# EAGLE design main_board (EAGLE 9.6.2)

## Sheet 1 of 2
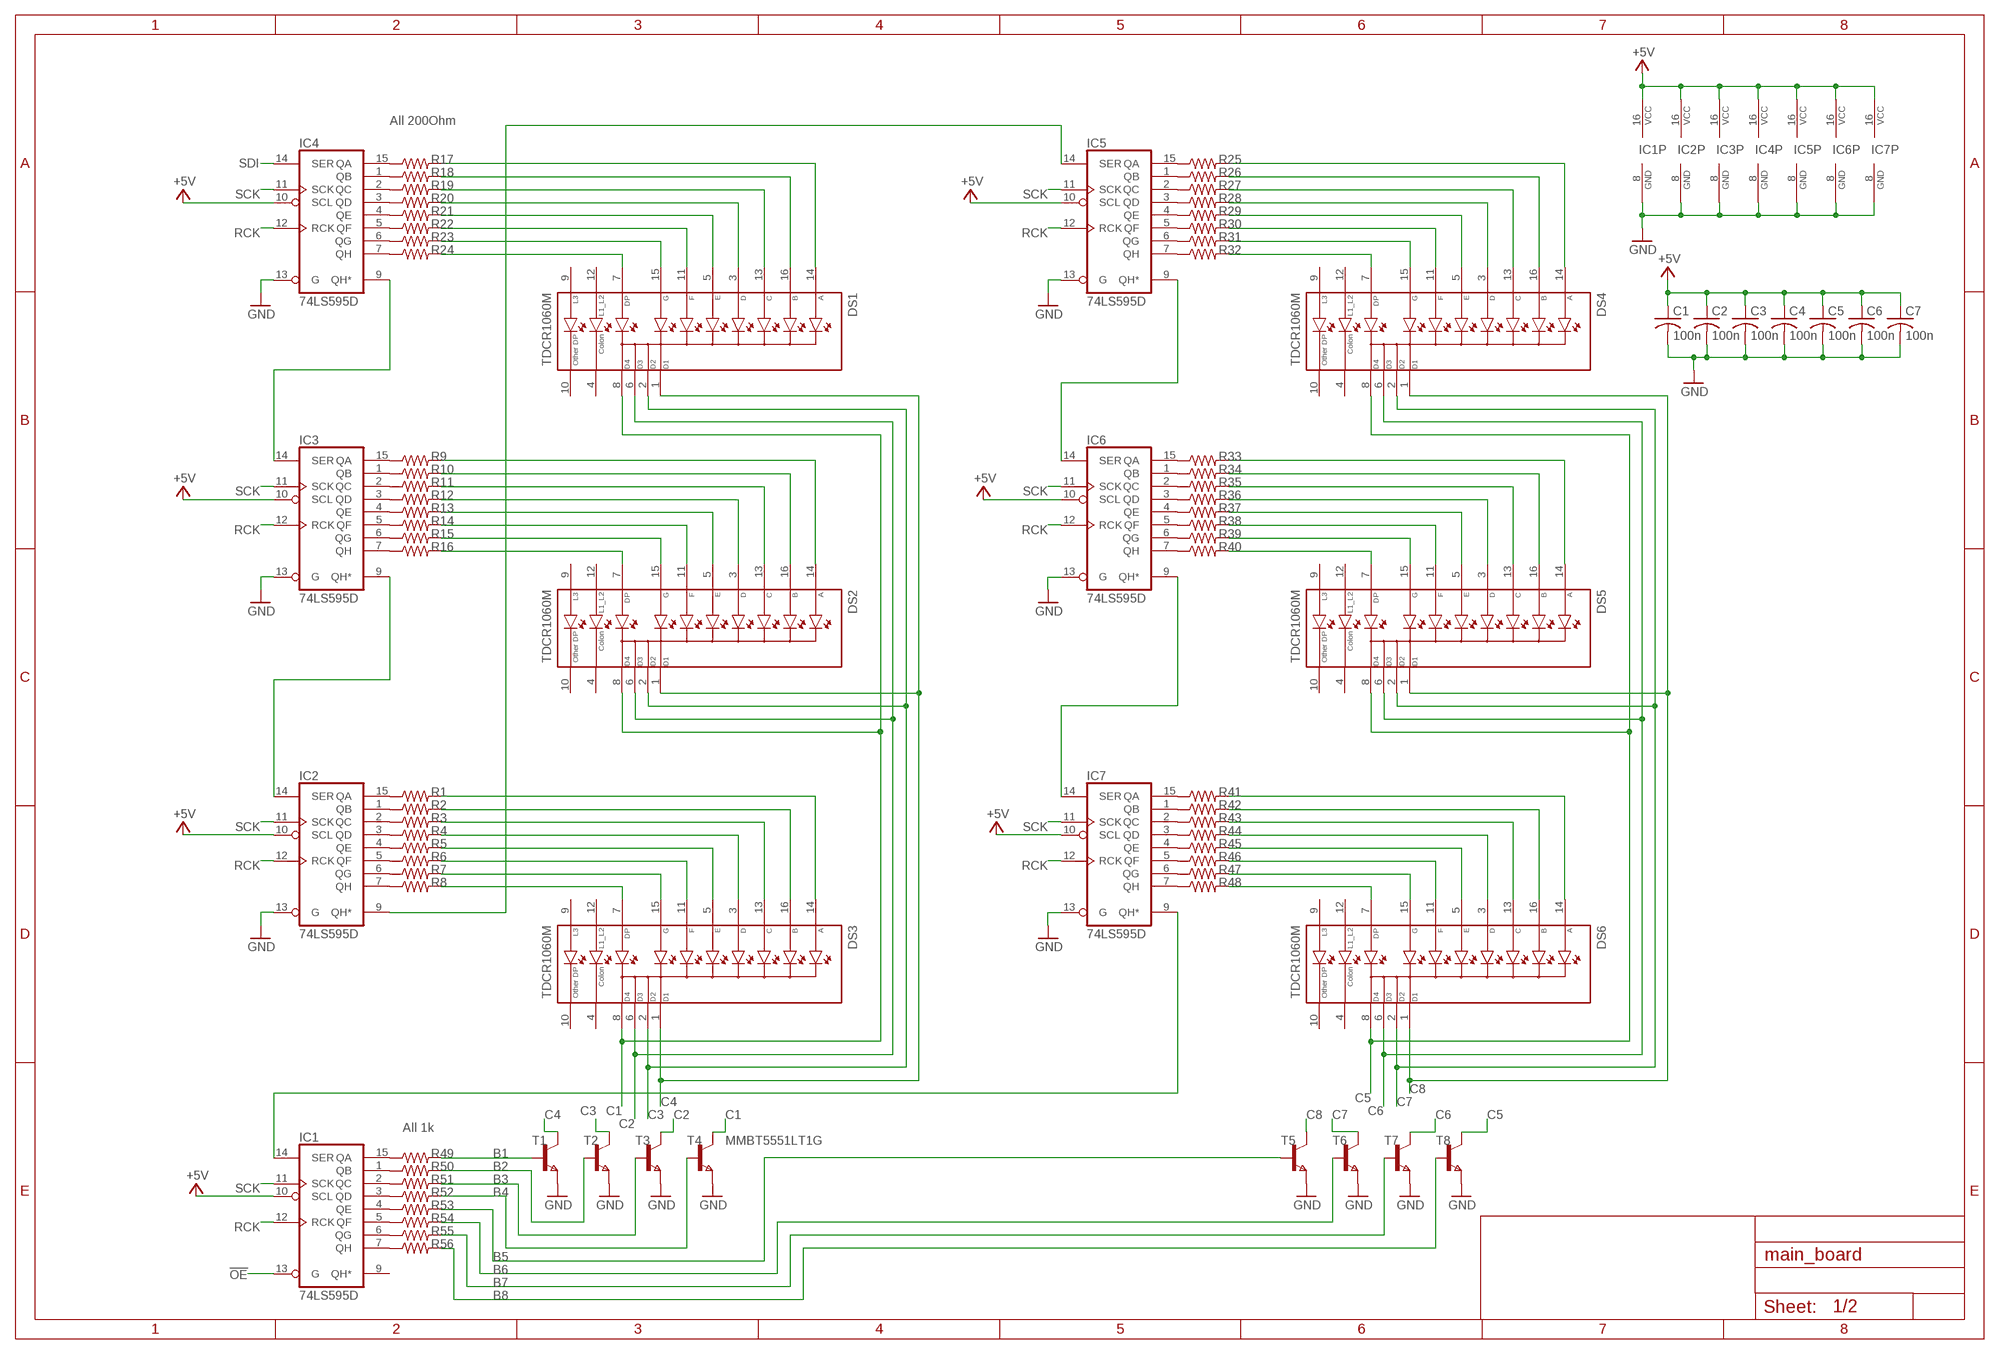
[diagram p0: schematic, sheet 1]

### Parts
C1  100n  C-USC0603  [C0603]
C2  100n  C-USC0603  [C0603]
C3  100n  C-USC0603  [C0603]
C4  100n  C-USC0603  [C0603]
C5  100n  C-USC0603  [C0603]
C6  100n  C-USC0603  [C0603]
C7  100n  C-USC0603  [C0603]
DS1  TDCR1060M  [DISPLAY_TDCR1060M]
DS2  TDCR1060M  [DISPLAY_TDCR1060M]
DS3  TDCR1060M  [DISPLAY_TDCR1060M]
DS4  TDCR1060M  [DISPLAY_TDCR1060M]
DS5  TDCR1060M  [DISPLAY_TDCR1060M]
DS6  TDCR1060M  [DISPLAY_TDCR1060M]
IC1  74LS595D  [SO16]
IC2  74LS595D  [SO16]
IC3  74LS595D  [SO16]
IC4  74LS595D  [SO16]
IC5  74LS595D  [SO16]
IC6  74LS595D  [SO16]
IC7  74LS595D  [SO16]
R1  R-US_R0603  [R0603]
R2  R-US_R0603  [R0603]
R3  R-US_R0603  [R0603]
R4  R-US_R0603  [R0603]
R5  R-US_R0603  [R0603]
R6  R-US_R0603  [R0603]
R7  R-US_R0603  [R0603]
R8  R-US_R0603  [R0603]
R9  R-US_R0603  [R0603]
R10  R-US_R0603  [R0603]
R11  R-US_R0603  [R0603]
R12  R-US_R0603  [R0603]
R13  R-US_R0603  [R0603]
R14  R-US_R0603  [R0603]
R15  R-US_R0603  [R0603]
R16  R-US_R0603  [R0603]
R17  R-US_R0603  [R0603]
R18  R-US_R0603  [R0603]
R19  R-US_R0603  [R0603]
R20  R-US_R0603  [R0603]
R21  R-US_R0603  [R0603]
R22  R-US_R0603  [R0603]
R23  R-US_R0603  [R0603]
R24  R-US_R0603  [R0603]
R25  R-US_R0603  [R0603]
R26  R-US_R0603  [R0603]
R27  R-US_R0603  [R0603]
R28  R-US_R0603  [R0603]
R29  R-US_R0603  [R0603]
R30  R-US_R0603  [R0603]
R31  R-US_R0603  [R0603]
R32  R-US_R0603  [R0603]
R33  R-US_R0603  [R0603]
R34  R-US_R0603  [R0603]
R35  R-US_R0603  [R0603]
R36  R-US_R0603  [R0603]
R37  R-US_R0603  [R0603]
R38  R-US_R0603  [R0603]
R39  R-US_R0603  [R0603]
R40  R-US_R0603  [R0603]
R41  R-US_R0603  [R0603]
R42  R-US_R0603  [R0603]
R43  R-US_R0603  [R0603]
R44  R-US_R0603  [R0603]
R45  R-US_R0603  [R0603]
R46  R-US_R0603  [R0603]
R47  R-US_R0603  [R0603]
R48  R-US_R0603  [R0603]
R49  R-US_R0603  [R0603]
R50  R-US_R0603  [R0603]
R51  R-US_R0603  [R0603]
R52  R-US_R0603  [R0603]
R53  R-US_R0603  [R0603]
R54  R-US_R0603  [R0603]
R55  R-US_R0603  [R0603]
R56  R-US_R0603  [R0603]
T1  NPNSOT23  [SOT-23]
T2  NPNSOT23  [SOT-23]
T3  NPNSOT23  [SOT-23]
T4  NPNSOT23  [SOT-23]
T5  NPNSOT23  [SOT-23]
T6  NPNSOT23  [SOT-23]
T7  NPNSOT23  [SOT-23]
T8  NPNSOT23  [SOT-23]

### Nets
!OE: IC1.13(G) ; also sheet 2
+5V: C1.1 C2.1 C3.1 C4.1 C5.1 C6.1 C7.1 IC1.10(SCL) IC1.16(VCC) IC2.10(SCL) IC2.16(VCC) IC3.10(SCL) IC3.16(VCC) IC4.10(SCL) IC4.16(VCC) IC5.10(SCL) IC5.16(VCC) IC6.10(SCL) IC6.16(VCC) IC7.10(SCL) IC7.16(VCC) ; also sheet 2
B1: R49.2 T1.3(B)
B2: R50.2 T2.3(B)
B3: R51.2 T3.3(B)
B4: R52.2 T4.3(B)
B5: R53.2 T5.3(B)
B6: R54.2 T6.3(B)
B7: R55.2 T7.3(B)
B8: R56.2 T8.3(B)
C1: DS1.8(D4) DS2.8(D4) DS3.8(D4) T4.1(C)
C2: DS1.6(D3) DS2.6(D3) DS3.6(D3) T3.1(C)
C3: DS1.2(D2) DS2.2(D2) DS3.2(D2) T2.1(C)
C4: DS1.1(D1) DS2.1(D1) DS3.1(D1) T1.1(C)
C5: DS4.8(D4) DS5.8(D4) DS6.8(D4) T8.1(C)
C6: DS4.6(D3) DS5.6(D3) DS6.6(D3) T7.1(C)
C7: DS4.2(D2) DS5.2(D2) DS6.2(D2) T6.1(C)
C8: DS4.1(D1) DS5.1(D1) DS6.1(D1) T5.1(C)
GND: C1.2 C2.2 C3.2 C4.2 C5.2 C6.2 C7.2 IC1.8(GND) IC2.8(GND) IC2.13(G) IC3.8(GND) IC3.13(G) IC4.8(GND) IC4.13(G) IC5.8(GND) IC5.13(G) IC6.8(GND) IC6.13(G) IC7.8(GND) IC7.13(G) T1.2(E) T2.2(E) T3.2(E) T4.2(E) T5.2(E) T6.2(E) T7.2(E) T8.2(E) ; also sheet 2
N$1: IC2.15(QA) R1.1
N$2: IC2.1(QB) R2.1
N$3: IC2.2(QC) R3.1
N$4: IC2.3(QD) R4.1
N$5: IC2.4(QE) R5.1
N$6: IC2.5(QF) R6.1
N$7: IC2.6(QG) R7.1
N$8: IC2.7(QH) R8.1
N$9: IC3.15(QA) R9.1
N$10: IC3.1(QB) R10.1
N$11: IC3.2(QC) R11.1
N$12: IC3.3(QD) R12.1
N$13: IC3.4(QE) R13.1
N$14: IC3.5(QF) R14.1
N$15: IC3.6(QG) R15.1
N$16: IC3.7(QH) R16.1
N$17: DS2.7(DP) R16.2
N$18: DS2.15(G) R15.2
N$19: DS2.11(F) R14.2
N$20: DS2.5(E) R13.2
N$21: DS2.3(D) R12.2
N$22: DS2.13(C) R11.2
N$23: DS2.16(B) R10.2
N$24: DS2.14(A) R9.2
N$25: DS3.7(DP) R8.2
N$26: DS3.15(G) R7.2
N$27: DS3.11(F) R6.2
N$28: DS3.5(E) R5.2
N$29: DS3.3(D) R4.2
N$30: DS3.13(C) R3.2
N$31: DS3.16(B) R2.2
N$32: DS3.14(A) R1.2
N$33: IC4.15(QA) R17.1
N$34: IC4.1(QB) R18.1
N$35: IC4.2(QC) R19.1
N$36: IC4.3(QD) R20.1
N$37: IC4.4(QE) R21.1
N$38: IC4.5(QF) R22.1
N$39: IC4.6(QG) R23.1
N$40: IC4.7(QH) R24.1
N$41: DS1.7(DP) R24.2
N$42: DS1.15(G) R23.2
N$43: DS1.11(F) R22.2
N$44: DS1.5(E) R21.2
N$45: DS1.3(D) R20.2
N$46: DS1.13(C) R19.2
N$47: DS1.16(B) R18.2
N$48: DS1.14(A) R17.2
N$49: IC5.15(QA) R25.1
N$50: IC5.1(QB) R26.1
N$51: IC5.2(QC) R27.1
N$52: IC5.3(QD) R28.1
N$53: IC5.4(QE) R29.1
N$54: IC5.5(QF) R30.1
N$55: IC5.6(QG) R31.1
N$56: IC5.7(QH) R32.1
N$57: DS4.7(DP) R32.2
N$58: DS4.15(G) R31.2
N$59: DS4.11(F) R30.2
N$60: DS4.5(E) R29.2
N$61: DS4.3(D) R28.2
N$62: DS4.13(C) R27.2
N$63: DS4.16(B) R26.2
N$64: DS4.14(A) R25.2
N$65: IC6.15(QA) R33.1
N$66: IC6.1(QB) R34.1
N$67: IC6.2(QC) R35.1
N$68: IC6.3(QD) R36.1
N$69: IC6.4(QE) R37.1
N$70: IC6.5(QF) R38.1
N$71: IC6.6(QG) R39.1
N$72: IC6.7(QH) R40.1
N$73: DS5.7(DP) R40.2
N$74: DS5.15(G) R39.2
N$75: DS5.11(F) R38.2
N$76: DS5.5(E) R37.2
N$77: DS5.3(D) R36.2
N$78: DS5.13(C) R35.2
N$79: DS5.16(B) R34.2
N$80: DS5.14(A) R33.2
N$81: IC7.15(QA) R41.1
N$82: IC7.1(QB) R42.1
N$83: IC7.2(QC) R43.1
N$84: IC7.3(QD) R44.1
N$85: IC7.4(QE) R45.1
N$86: IC7.5(QF) R46.1
N$87: IC7.6(QG) R47.1
N$88: IC7.7(QH) R48.1
N$89: DS6.7(DP) R48.2
N$90: DS6.15(G) R47.2
N$91: DS6.11(F) R46.2
N$92: DS6.5(E) R45.2
N$93: DS6.3(D) R44.2
N$94: DS6.13(C) R43.2
N$95: DS6.16(B) R42.2
N$96: DS6.14(A) R41.2
N$97: IC2.9(QH*) IC5.14(SER)
N$98: IC5.9(QH*) IC6.14(SER)
N$99: IC6.9(QH*) IC7.14(SER)
N$100: IC3.14(SER) IC4.9(QH*)
N$101: IC2.14(SER) IC3.9(QH*)
N$102: IC1.14(SER) IC7.9(QH*)
N$113: IC1.15(QA) R49.1
N$114: IC1.1(QB) R50.1
N$115: IC1.2(QC) R51.1
N$116: IC1.3(QD) R52.1
N$117: IC1.4(QE) R53.1
N$118: IC1.5(QF) R54.1
N$119: IC1.6(QG) R55.1
N$120: IC1.7(QH) R56.1
RCK: IC1.12(RCK) IC2.12(RCK) IC3.12(RCK) IC4.12(RCK) IC5.12(RCK) IC6.12(RCK) IC7.12(RCK) ; also sheet 2
SCK: IC1.11(SCK) IC2.11(SCK) IC3.11(SCK) IC4.11(SCK) IC5.11(SCK) IC6.11(SCK) IC7.11(SCK) ; also sheet 2
SDI: IC4.14(SER) ; also sheet 2
Unconnected: DS1.4 DS1.9(L3) DS1.10 DS1.12(L1_L2) DS2.4 DS2.9(L3) DS2.10 DS2.12(L1_L2) DS3.4 DS3.9(L3) DS3.10 DS3.12(L1_L2) DS4.4 DS4.9(L3) DS4.10 DS4.12(L1_L2) DS5.4 DS5.9(L3) DS5.10 DS5.12(L1_L2) DS6.4 DS6.9(L3) DS6.10 DS6.12(L1_L2) IC1.9(QH*)

### Notes on the sheet
- All 200Ohm
- All 1k
- MMBT5551LT1G

## Sheet 2 of 2
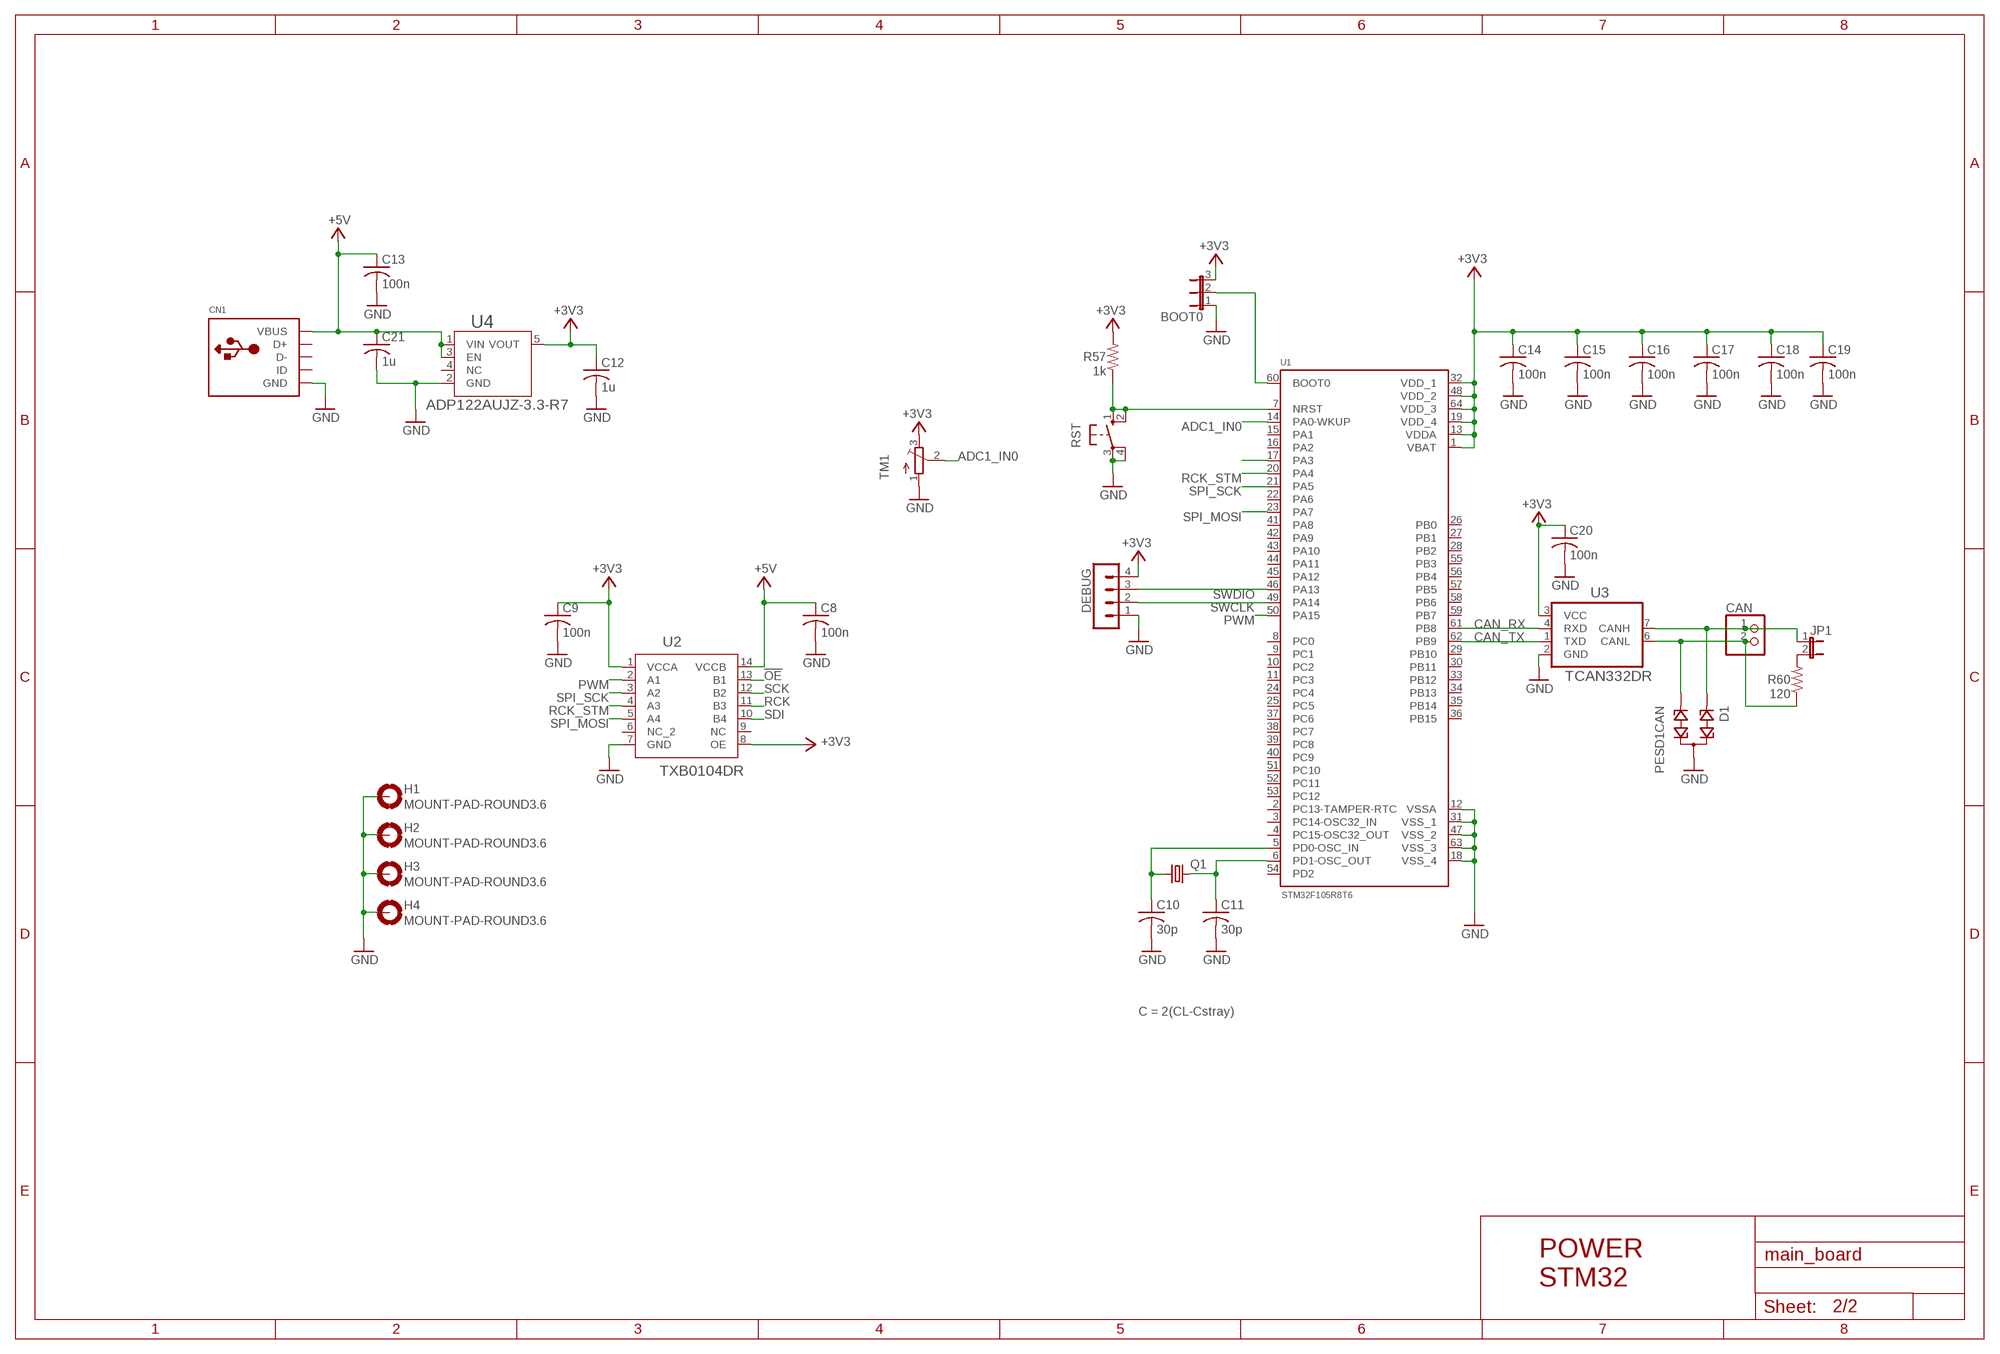
[diagram p1: schematic, sheet 2]

### Parts
BOOT0  JP2E  [JP2]
C8  100n  C-USC0603  [C0603]
C9  100n  C-USC0603  [C0603]
C10  30p  C-USC0603  [C0603]
C11  30p  C-USC0603  [C0603]
C12  1u  C-USC0603  [C0603]
C13  100n  C-USC0603  [C0603]
C14  100n  C-USC0603  [C0603]
C15  100n  C-USC0603  [C0603]
C16  100n  C-USC0603  [C0603]
C17  100n  C-USC0603  [C0603]
C18  100n  C-USC0603  [C0603]
C19  100n  C-USC0603  [C0603]
C20  100n  C-USC0603  [C0603]
C21  1u  C-USC0603  [C0603]
CAN  PINHD-1X2  [1X02]
CN1  USBMINIB  [USB-MINIB]
D1  PESD1CAN  [SOT23]
DEBUG  MA04-1  [MA04-1]
H1  MOUNT-PAD-ROUND3.6  [3,6-PAD]
H2  MOUNT-PAD-ROUND3.6  [3,6-PAD]
H3  MOUNT-PAD-ROUND3.6  [3,6-PAD]
H4  MOUNT-PAD-ROUND3.6  [3,6-PAD]
JP1  JP1E  [JP1]
Q1  CRYSTALHC49S  [HC49/S]
R57  1k  R-US_R0805  [R0805]
R60  120  R-US_R0805  [R0805]
RST  10-XX  [B3F-10XX]
TM1  TRIMPOT3386  [TRIM-3386]
U1  STM32F105R8T6  [QFP50P1200X1200X160-64N]
U2  TXB0104DR  [D14]
U3  TCAN332DR  [SOIC127P599X175-8N]
U4  ADP122AUJZ-3.3-R7  [SOT95P280X100-5N]

### Nets
!OE: U2.13(B1) ; also sheet 1
+3V3: BOOT0.3 C9.1 C12.1 C14.1 C15.1 C16.1 C17.1 C18.1 C19.1 C20.1 DEBUG.4 R57.2 TM1.3(E) U1.1(VBAT) U1.13(VDDA) U1.19(VDD_4) U1.32(VDD_1) U1.48(VDD_2) U1.64(VDD_3) U2.1(VCCA) U2.8(OE) U3.3(VCC) U4.5(VOUT)
+5V: C8.1 C13.1 C21.1 CN1.VBUS U2.14(VCCB) U4.1(VIN) U4.3(EN) ; also sheet 1
ADC1_IN0: TM1.2(S) U1.14(PA0-WKUP)
CAN_RX: U1.61(PB8) U3.4(RXD)
CAN_TX: U1.62(PB9) U3.1(TXD)
GND: BOOT0.1 C8.2 C9.2 C10.2 C11.2 C12.2 C13.2 C14.2 C15.2 C16.2 C17.2 C18.2 C19.2 C20.2 C21.2 CN1.GND D1.3 DEBUG.1 H1.B3,6(MOUNT) H2.B3,6(MOUNT) H3.B3,6(MOUNT) H4.B3,6(MOUNT) RST.3(P) RST.4(P1) TM1.1(A) U1.12(VSSA) U1.18(VSS_4) U1.31(VSS_1) U1.47(VSS_2) U1.63(VSS_3) U2.7(GND) U3.2(GND) U4.2(GND) ; also sheet 1
N$103: CAN.1 D1.1 JP1.1 U3.7(CANH)
N$104: CAN.2 D1.2 R60.1 U3.6(CANL)
N$105: JP1.2 R60.2
N$107: R57.1 RST.1(S) RST.2(S1) U1.7(NRST)
N$108: C10.1 Q1.1 U1.5(PD0-OSC_IN)
N$109: C11.1 Q1.2 U1.6(PD1-OSC_OUT)
N$110: BOOT0.2 U1.60(BOOT0)
N$121: U1.17(PA3)
PWM: U1.50(PA15) U2.2(A1)
RCK: U2.11(B3) ; also sheet 1
RCK_STM: U1.20(PA4) U2.4(A3)
SCK: U2.12(B2) ; also sheet 1
SDI: U2.10(B4) ; also sheet 1
SPI_MOSI: U1.23(PA7) U2.5(A4)
SPI_SCK: U1.21(PA5) U2.3(A2)
SWCLK: DEBUG.2 U1.49(PA14)
SWDIO: DEBUG.3 U1.46(PA13)
Unconnected: CN1.D+ CN1.D- CN1.ID U1.2(PC13-TAMPER-RTC) U1.3(PC14-OSC32_IN) U1.4(PC15-OSC32_OUT) U1.8(PC0) U1.9(PC1) U1.10(PC2) U1.11(PC3) U1.15(PA1) U1.16(PA2) U1.22(PA6) U1.24(PC4) U1.25(PC5) U1.26(PB0) U1.27(PB1) U1.28(PB2) U1.29(PB10) U1.30(PB11) U1.33(PB12) U1.34(PB13) U1.35(PB14) U1.36(PB15) U1.37(PC6) U1.38(PC7) U1.39(PC8) U1.40(PC9) U1.41(PA8) U1.42(PA9) U1.43(PA10) U1.44(PA11) U1.45(PA12) U1.51(PC10) U1.52(PC11) U1.53(PC12) U1.54(PD2) U1.55(PB3) U1.56(PB4) U1.57(PB5) U1.58(PB6) U1.59(PB7) U2.6(NC_2) U2.9(NC) U4.4(NC)

### Notes on the sheet
- C = 2(CL-Cstray)
- POWER
  STM32

## Library data of the parts
BOOT0 = jumper:JP2E: JUMPER
C1-C21 = adafruit:C-US: CAPACITOR, American symbol
CAN = pinhead:PINHD-1X2: PIN HEADER
CN1 = adafruit:USB: USB Connectors USBMINIB - Surface Mount Female Mini-B USB Connector 4UConnector: 06564 By microbuilder.eu Thru-hole RA Female Mini-B USB Connector 4UConnector: 18732 By ladyada.net
D1 = diode:PESD1CAN: CAN bus ESD protection diode Source: http://www.nxp.com/documents/data_sheet/PESD1CAN.pdf
DEBUG = con-lstb:MA04-1: PIN HEADER; OC_FARNELL: unknown; OC_NEWARK: unknown
DS1-DS6 = TDCR1060M:TDCR1060M; CHECK_PRICES: https://www.snapeda.com/parts/TDCR1060M/Vishay+Semiconductor+Opto+Division/view-part/?ref=eda; DESCRIPTION: Display Modules - LED Character and Numeric Red 7-Segment Clock 4 Character Common Cathode 2V 20mA 0.504 H x 1.583 W x 0.276 D (12.80mm x 40.20mm x 7.00mm) 16-DIP (0.400, 10.16mm); DIGIKEY_PART_NUMBER: TDCR1060M-ND; MF: Vishay Semiconductor; MP: TDCR1060M; PACKAGE: None; PURCHASE-URL: https://www.snapeda.com/api/url_track_click_mouser/?unipart_id=2873271&manufacturer=Vishay Semiconductor&part_name=TDCR1060M&search_term=None; SNAPEDA_LINK: https://www.snapeda.com/parts/TDCR1060M/Vishay+Semiconductor+Opto+Division/view-part/?ref=snap
H1-H4 = holes:MOUNT-PAD-ROUND: MOUNTING PAD, round
IC1-IC7 = 74xx-us:74*595: 8-bit SHIFT REGISTER, output latch
JP1 = jumper:JP1E: JUMPER
Q1 = adafruit:CRYSTAL: CRYSTAL; OC_FARNELL: 1667008; OC_NEWARK: unknown
R1-R57 R60 = adafruit:R-US_: RESISTOR, American symbol
RST = switch-omron:10-XX: OMRON SWITCH; MPN: B3F-1000; OC_FARNELL: 176432; OC_NEWARK: 36M3542
T1-T8 = zetex:NPNSOT23: NPN TRANSISTOR; MPN: DSS20201L-7; OC_FARNELL: 1710688; OC_NEWARK: 25R4555
TM1 = adafruit:TRIMPOT: SMT trimmer potentiometer part number TC33X http://www.ladyada.net/library/eagle
U1 = STM32F105R8T6:STM32F105R8T6: Mainstream Connectivity line, ARM Cortex-M3 with 64 Kbytes Flash, 72 MHz CPU, CAN, USB 2.0 OTG; CHECK_PRICES: https://www.snapeda.com/parts/STM32F105R8T6/STMicroelectronics/view-part/?ref=eda; DESCRIPTION: ARM® Cortex®-M3 STM32F1 Microcontroller IC 32-Bit 72MHz 64KB (64K x 8) FLASH 64-LQFP (10x10); DIGIKEY_PART_NUMBER: 497-8922-ND; MF: STMicroelectronics; MP: STM32F105R8T6; PACKAGE: LQFP-64 STMicroelectronics; PURCHASE-URL: https://www.snapeda.com/api/url_track_click_mouser/?unipart_id=423032&manufacturer=STMicroelectronics&part_name=STM32F105R8T6&search_term=None; SNAPEDA_LINK: https://www.snapeda.com/parts/STM32F105R8T6/STMicroelectronics/view-part/?ref=snap
U2 = temp_sens_proj:TXB0104DR; COPYRIGHT: Copyright (C) 2023 Ultra Librarian. All rights reserved.; MANUFACTURER_PART_NUMBER: TXB0104DR; MFR_NAME: Texas Instruments
U3 = TCAN332DR:TCAN332DR: Check availability <https://pricing.snapeda.com/parts/TCAN332DR/Texas%20Instruments/view-part?ref=eda>; AVAILABILITY: In Stock; CHECK_PRICES: https://www.snapeda.com/parts/TCAN332DR/Texas+Instruments/view-part/?ref=eda; DESCRIPTION: 3.3-V CAN Transceivers; MF: Texas Instruments; MP: TCAN332DR; PACKAGE: SOIC-8 Texas Instruments; PRICE: None; PURCHASE-URL: https://www.snapeda.com/api/url_track_click_mouser/?unipart_id=381755&manufacturer=Texas Instruments&part_name=TCAN332DR&search_term=can; SNAPEDA_LINK: https://www.snapeda.com/parts/TCAN332DR/Texas+Instruments/view-part/?ref=snap
U4 = Analog Devices_By_element14_Batch_1:ADP122AUJZ-3.3-R7: CMOS Linear Regulators; MPN: ADP122AUJZ-3.3-R7; OC_FARNELL: 1858064; OC_NEWARK: 60R3274; PACKAGE: SOT-23-5; SUPPLIER: ANALOG DEVICES

## Board
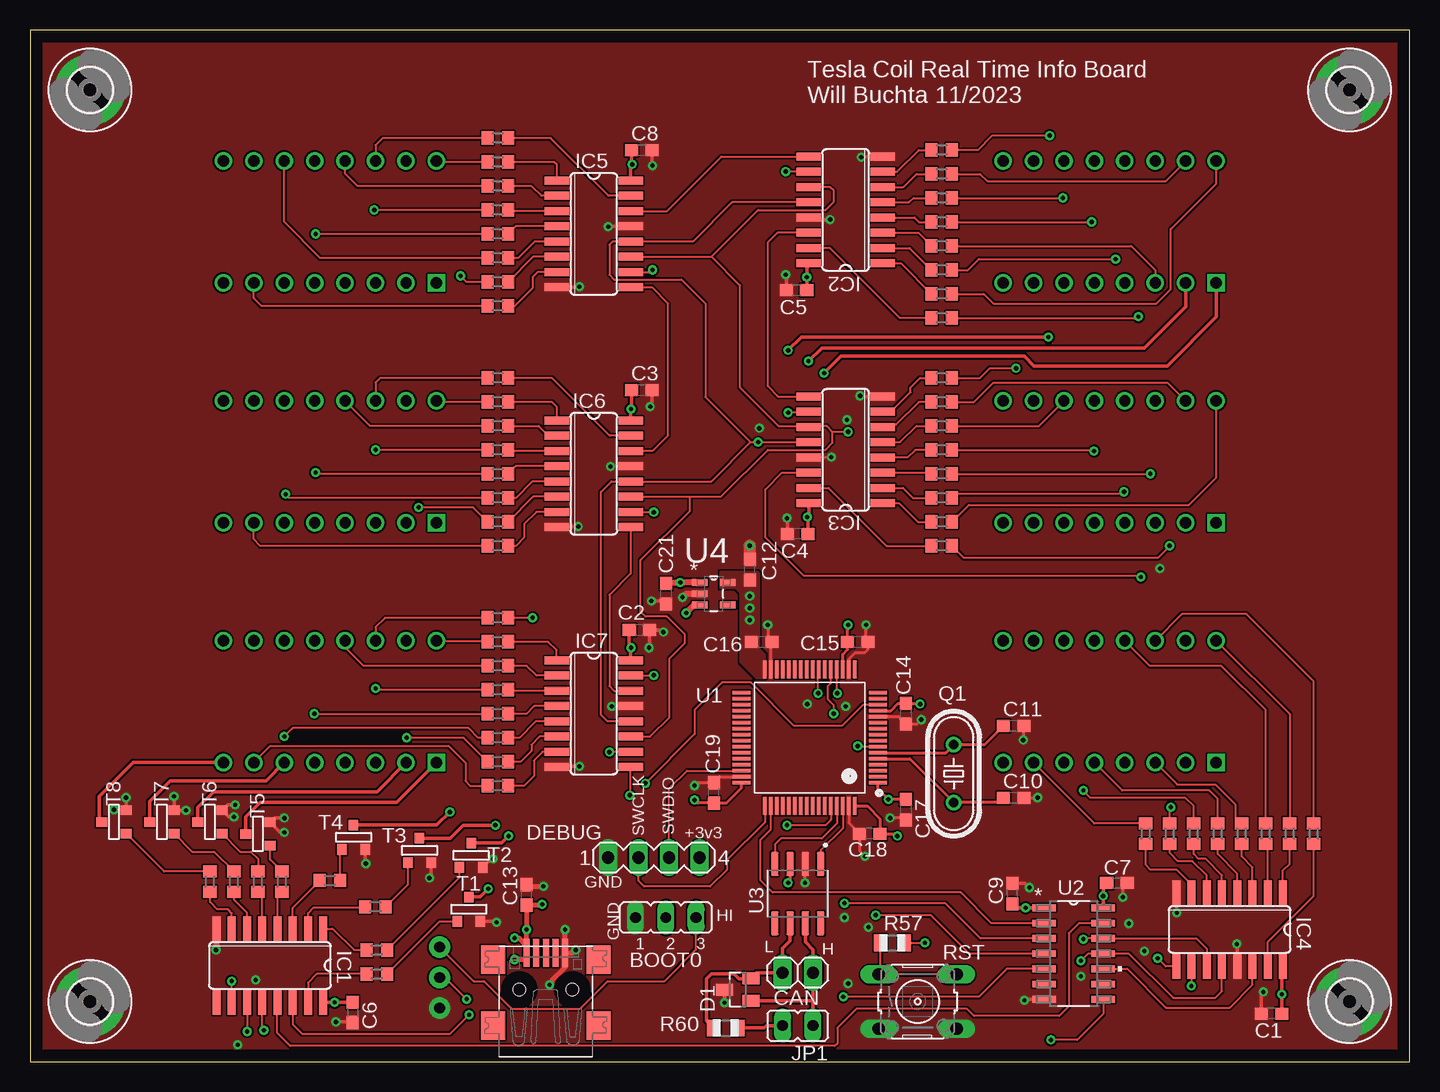
[diagram p2: board, top side]
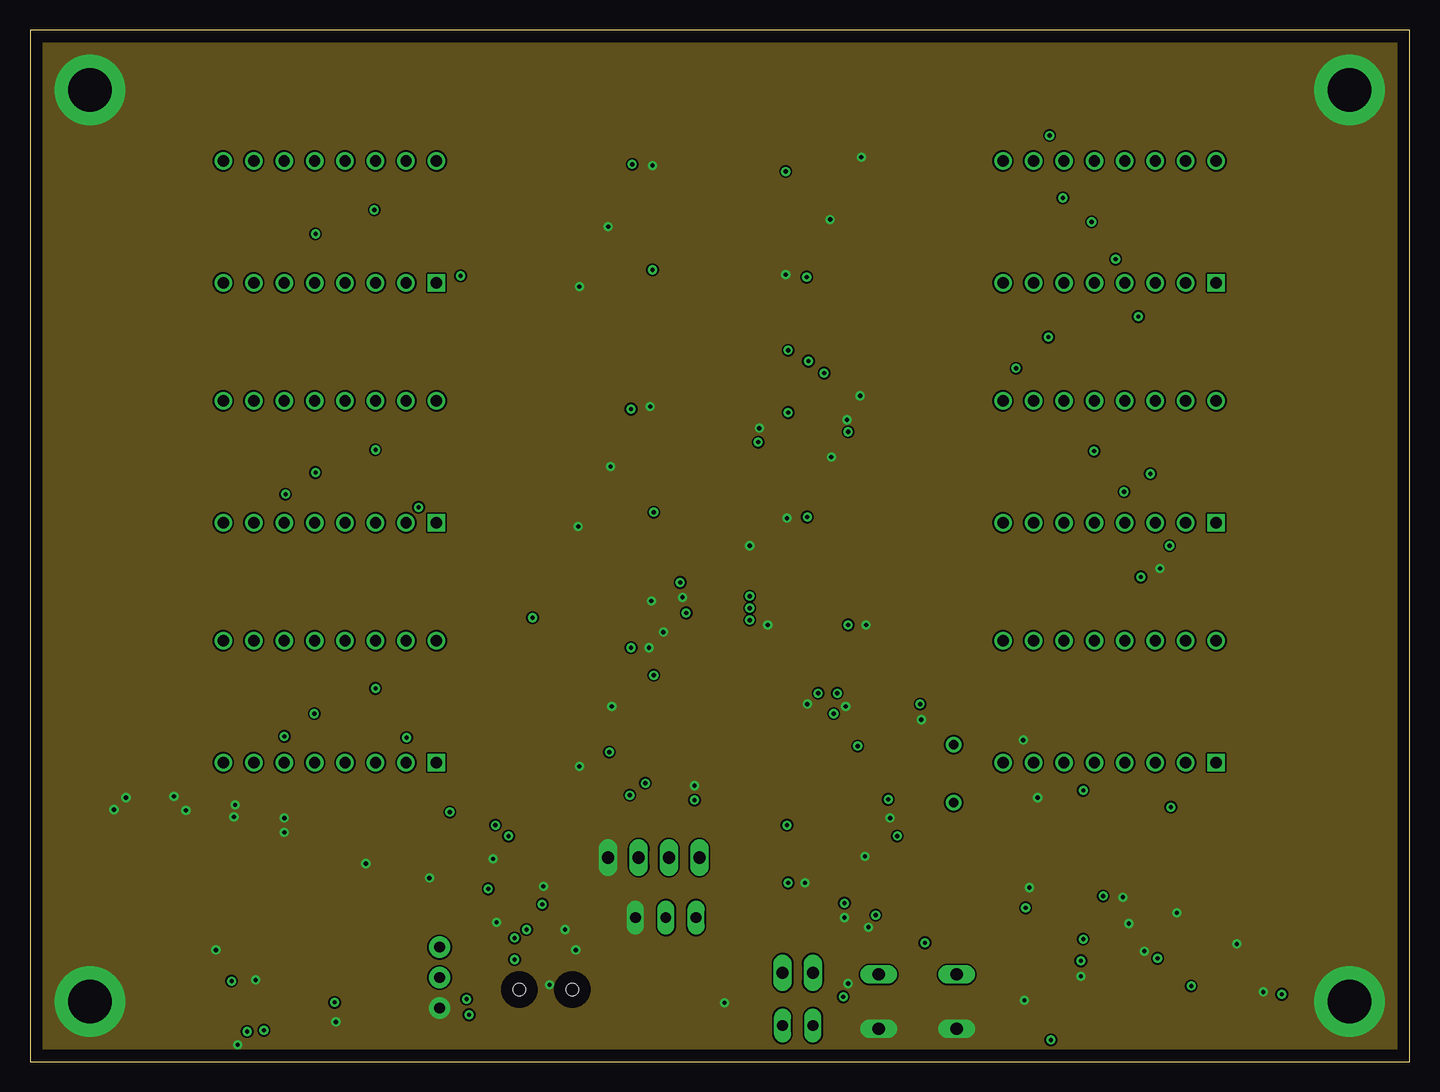
[diagram p3: board, inner layer Route2]
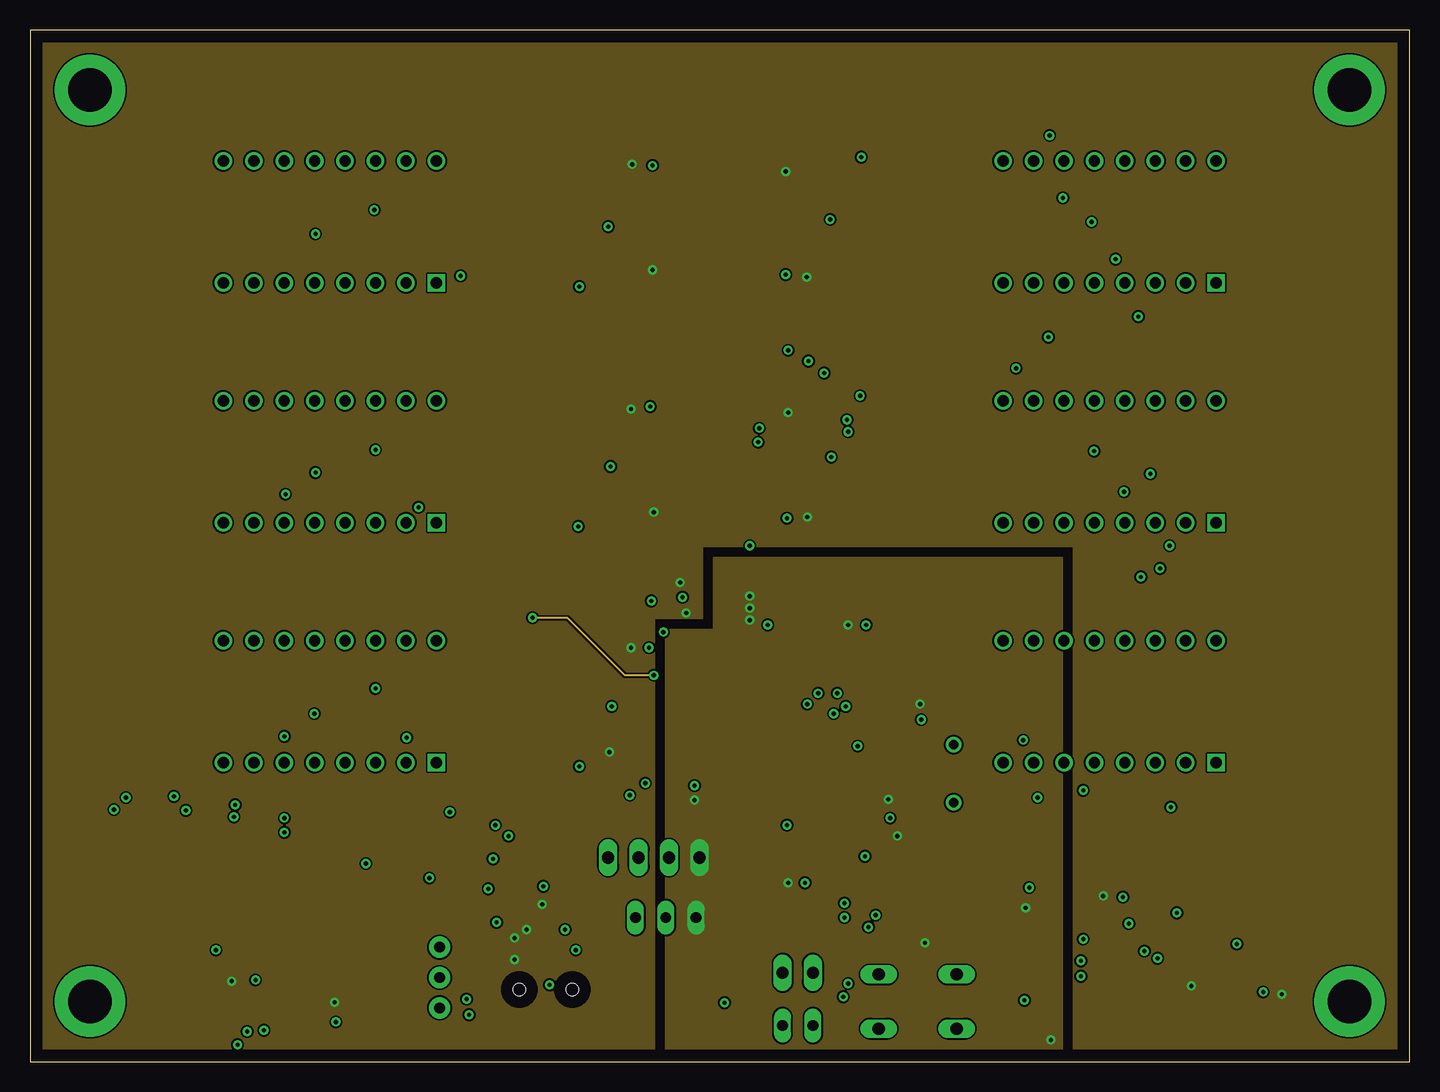
[diagram p4: board, inner layer Route15]
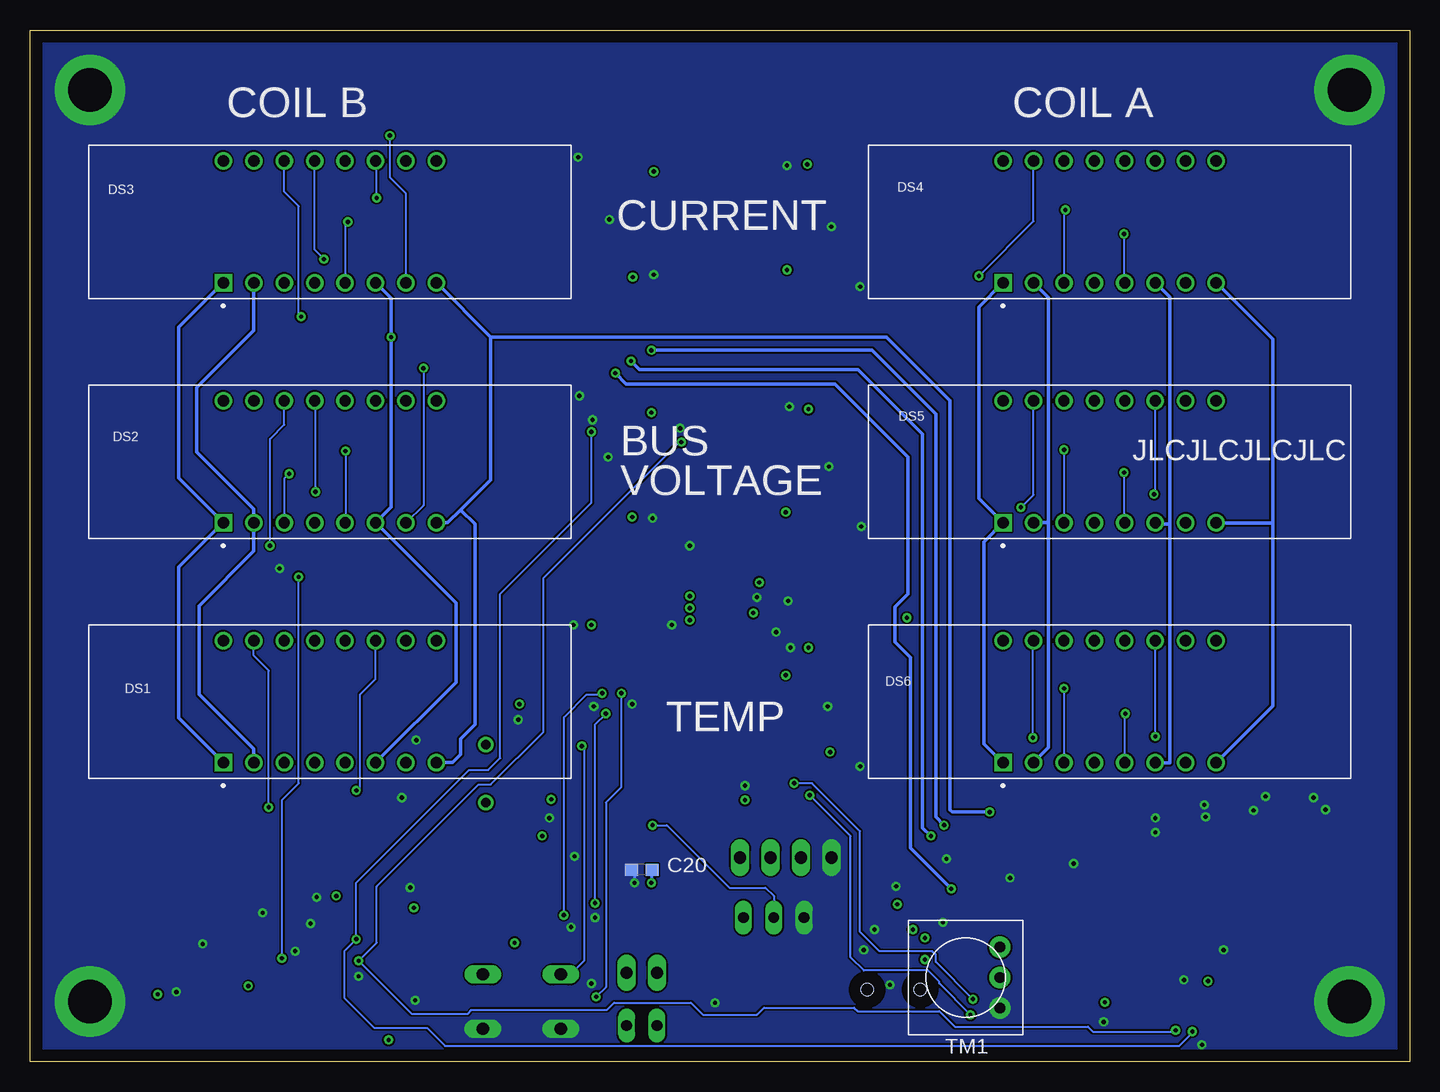
[diagram p5: board, bottom side, seen from below]

Size 115 x 86 mm. Coordinates in mm from the lower left corner, seen from the top.
Outline: 0,0 115,0 115,86 0,86 0,0
Copper layers (1+2*15+16): Top 0.035mm / dielectric 0.15mm / Route2 0.035mm / dielectric 0.15mm / Route15 0.035mm / dielectric 0.2mm / Bottom 0.035mm
Design rules "default *": minimum track width 6mil, minimum drill 0.35mm, track to track 6mil, track to pad 6mil, pad to pad 6mil, via to via 6mil, smd to smd 6mil, copper to edge 40mil, drill to drill 6mil, minimum pad ring 10mil, minimum via ring 8mil, stop-mask expansion 4mil, vias tented up to drill 0mil, thermal gap 10mil

### Footprints (pad centres in the part's own frame; a part is rotated, then mirrored left to right if it is on the bottom)
JP2 = drill 0.914 long: 1 -2.54,0; 2 0,0; 3 2.54,0
C0603 = smd 1.1 x 1: 1 -0.85,0; 2 0.85,0
1X02 = drill 1.016 long: 1 -1.27,0; 2 1.27,0
USB-MINIB = smd 0.5 x 2.308: D+ 0,4.064; D- -0.8,4.064; GND 1.6,4.064; ID 0.8,4.064; VBUS -1.6,4.064 | smd 2 x 2.4: GND1 -4.4,-2; GND2 -4.4,3.5; GND3 4.4,3.5; GND4 4.4,-2 | hole 1: -2.2,1; 2.2,1
SOT23 = smd 1 x 1.4: 1 -0.95,-1.1; 2 0.95,-1.1; 3 0,1.1
MA04-1 = drill 1.016 long: 1 -3.81,0; 2 -1.27,0; 3 1.27,0; 4 3.81,0
DISPLAY_TDCR1060M = drill 0.95 square: 1 -8.89,-5.08 | drill 0.95: 2 -6.35,-5.08; 3 -3.81,-5.08; 4 -1.27,-5.08; 5 1.27,-5.08; 6 3.81,-5.08; 7 6.35,-5.08; 8 8.89,-5.08; 9 8.89,5.08; 10 6.35,5.08; 11 3.81,5.08; 12 1.27,5.08; 13 -1.27,5.08; 14 -3.81,5.08; 15 -6.35,5.08; 16 -8.89,5.08
3,6-PAD = drill 3.6 pad 5.842: B3,6 0,0
SO16 = smd 0.66 x 2.032: 1 -4.445,-3.073; 2 -3.175,-3.073; 3 -1.905,-3.073; 4 -0.635,-3.073; 5 0.635,-3.073; 6 1.905,-3.073; 7 3.175,-3.073; 8 4.445,-3.073; 9 4.445,3.073; 10 3.175,3.073; 11 1.905,3.073; 12 0.635,3.073; 13 -0.635,3.073; 14 -1.905,3.073; 15 -3.175,3.073; 16 -4.445,3.073
JP1 = drill 0.914 long: 1 0,-1.27; 2 0,1.27
HC49/S = drill 0.813: 1 -2.413,0; 2 2.413,0
R0603 = smd 1 x 1.1: 1 -0.85,0; 2 0.85,0
R0805 = smd 1.1 x 1.4: 1 -1,0; 2 1,0
B3F-10XX = drill 1.016 long: 1 -3.251,2.261; 2 3.251,2.261; 3 -3.251,-2.261; 4 3.251,-2.261
SOT-23 = smd 0.787 x 0.889: 1 0.025,-1.016; 2 -0.94,1.016; 3 0.991,1.016
TRIM-3386 = drill 0.9 pad 1.778: 1 -2.54,-2.857; 2 0,-2.857; 3 2.54,-2.857
QFP50P1200X1200X160-64N = smd 1.5 x 0.3: 1 -5.7,3.75; 2 -5.7,3.25; 3 -5.7,2.75; 4 -5.7,2.25; 5 -5.7,1.75; 6 -5.7,1.25; 7 -5.7,0.75; 8 -5.7,0.25; 9 -5.7,-0.25; 10 -5.7,-0.75; 11 -5.7,-1.25; 12 -5.7,-1.75; 13 -5.7,-2.25; 14 -5.7,-2.75; 15 -5.7,-3.25; 16 -5.7,-3.75; 33 5.7,-3.75; 34 5.7,-3.25; 35 5.7,-2.75; 36 5.7,-2.25; 37 5.7,-1.75; 38 5.7,-1.25; 39 5.7,-0.75; 40 5.7,-0.25; 41 5.7,0.25; 42 5.7,0.75; 43 5.7,1.25; 44 5.7,1.75; 45 5.7,2.25; 46 5.7,2.75; 47 5.7,3.25; 48 5.7,3.75 | smd 0.3 x 1.5: 17 -3.75,-5.7; 18 -3.25,-5.7; 19 -2.75,-5.7; 20 -2.25,-5.7; 21 -1.75,-5.7; 22 -1.25,-5.7; 23 -0.75,-5.7; 24 -0.25,-5.7; 25 0.25,-5.7; 26 0.75,-5.7; 27 1.25,-5.7; 28 1.75,-5.7; 29 2.25,-5.7; 30 2.75,-5.7; 31 3.25,-5.7; 32 3.75,-5.7; 49 3.75,5.7; 50 3.25,5.7; 51 2.75,5.7; 52 2.25,5.7; 53 1.75,5.7; 54 1.25,5.7; 55 0.75,5.7; 56 0.25,5.7; 57 -0.25,5.7; 58 -0.75,5.7; 59 -1.25,5.7; 60 -1.75,5.7; 61 -2.25,5.7; 62 -2.75,5.7; 63 -3.25,5.7; 64 -3.75,5.7
D14 = smd 1.981 x 0.559: 1 -2.464,3.81; 2 -2.464,2.54; 3 -2.464,1.27; 4 -2.464,0; 5 -2.464,-1.27; 6 -2.464,-2.54; 7 -2.464,-3.81; 8 2.464,-3.81; 9 2.464,-2.54; 10 2.464,-1.27; 11 2.464,0; 12 2.464,1.27; 13 2.464,2.54; 14 2.464,3.81
SOIC127P599X175-8N = smd 1.97 x 0.6: 1 -2.47,1.905; 2 -2.47,0.635; 3 -2.47,-0.635; 4 -2.47,-1.905; 5 2.47,-1.905; 6 2.47,-0.635; 7 2.47,0.635; 8 2.47,1.905
SOT95P280X100-5N = smd 1.321 x 0.559: 1 -1.168,0.94; 2 -1.168,0; 3 -1.168,-0.94; 4 1.168,-0.94; 5 1.168,0.94

### Placement (x,y rotation side)
BOOT0  53,12 0 top
C1  103.5,4 180 top
C2  50.8,36 0 top
C3  51,56 0 top
C4  64,44 180 top
C5  63.9,64.3 180 top
C6  26.9,4.1 270 top
C7  90.6,14.9 0 top
C8  51,76 0 top
C9  81.9,14 90 top
C10  82,22 0 top
C11  82,28 0 top
C12  60,41 90 top
C13  41.4,13.9 90 top
C14  73,29 270 top
C15  69,35 0 top
C16  61,35 0 top
C17  73,21 270 top
C18  70,19 180 top
C19  57,22.4 90 top
C20  64,16 180 bottom
C21  53,39 270 top
CAN  64,7.4 180 top
CN1  43,5 0 top
D1  59,6 90 top
DEBUG  52,17 0 top
DS1  90,30 0 bottom
DS2  90,50 0 bottom
DS3  90,70 0 bottom
DS4  25,70 0 bottom
DS5  25,50 0 bottom
DS6  25,30 0 bottom
H1  5,81 0 top
H2  110,81 0 top
H3  5,5 0 top
H4  110,5 0 top
IC1  20,8 180 top
IC2  68,71 90 top
IC3  68,51 90 top
IC4  100,11 180 top
IC5  47,69 270 top
IC6  47,49 270 top
IC7  47,29 270 top
JP1  64,3 90 top
Q1  77,24 90 top
R1  76,62 0 top
R2  76,64 0 top
R3  76,66 0 top
R4  76,68 0 top
R5  76,70 0 top
R6  76,72 0 top
R7  76,74 0 top
R8  76,76 0 top
R9  76,43 0 top
R10  76,45 0 top
R11  76,47 0 top
R12  76,49 0 top
R13  76,51 0 top
R14  76,53 0 top
R15  76,55 0 top
R16  76,57 0 top
R17  107,19 90 top
R18  105,19 90 top
R19  103,19 90 top
R20  101,19 90 top
R21  99,19 90 top
R22  97,19 90 top
R23  95,19 90 top
R24  93,19 90 top
R25  39,77 180 top
R26  39,75 180 top
R27  39,73 180 top
R28  39,71 180 top
R29  39,69 180 top
R30  39,67 180 top
R31  39,65 180 top
R32  39,63 180 top
R33  39,57 180 top
R34  39,55 180 top
R35  39,53 180 top
R36  39,51 180 top
R37  39,49 180 top
R38  39,47 180 top
R39  39,45 180 top
R40  39,43 180 top
R41  39,37 180 top
R42  39,35 180 top
R43  39,33 180 top
R44  39,31 180 top
R45  39,29 180 top
R46  39,27 180 top
R47  39,25 180 top
R48  39,23 180 top
R49  28.9,7.3 0 top
R50  28.9,9.3 0 top
R51  28.8,12.9 0 top
R52  25,15.1 0 top
R53  21,15 90 top
R54  19,15 90 top
R55  17,15 90 top
R56  15,15 90 top
R57  71.9,9.9 0 top
R60  58,2.8 0 top
RST  74,5 0 top
T1  36.6,12.7 180 top
T2  36.8,17.2 180 top
T3  32.5,17.6 180 top
T4  27,18.7 180 top
T5  19,19 270 top
T6  15,20 270 top
T7  11,20 270 top
T8  7,20 270 top
TM1  37,7 90 bottom
U1  65,27 180 top
U2  87,9 0 top
U3  64,14 270 top
U4  57,39 0 top

### Tracks (layer width: path | path; a pad name or v marks a point on that pad's centre or on a via)
!OE
  Top 0.152: U2.13 87.44,11.54 86.6,10.7 86.6,4.6 85.8,3.8 78.7,3.8 78.1,4.4 68.9,4.4 67.3,2.8 67.3,1.5 67.1,1.3 21.7,1.3 20.6,2.4 20.6,4.89 IC1.13
+3V3  (via drill 0.35)
  Top 0.152: R57.2 v74.6,9.9 | v85.1,1.8 87.3,1.8 89.46,3.96 U2.8 | TM1.3 36.98,6.7 37.85,6.7 40.14,4.41 45.86,4.41 48.15,6.7 52.9,6.7 55.54,9.34 BOOT0.3
  Top 0.254: U1.48 59.3,22.8 58.05,21.55 C19.1 55.65,21.55 v55.4,21.8 | U1.19 67.75,33.95 68.15,34.35 C15.1 68.15,36.35 v68.2,36.4 | U1.13 71.75,29.25 72.35,29.85 C14.1 74.15,29.85 v74.2,29.8 | U1.1 70.7,22.7 v71.55,21.85 C17.1 | U1.64 69.8,21.3 70.85,20.25 C18.1 72.1,19 v72.3,18.8 | U3.3 63.37,15.06 v63.2,14.9
  Top 0.305: C9.1 82.24,12.81 v83,12.81 U2.1
  Bottom 0.254: v63.2,14.9 63.15,14.95 C20.1
  other vias: 60,38.8 60,37.8 60,36.8
  pour Route15 (no thermals): 53,0 53,36 57,36 57,42 59,42 86,42 86,40 86,0 85,0
  pour Top (no thermals): 57.5,39.5 58.8,39.5 59.2,39.1 59.2,33.3 60.5,32 61.3,32 61.3,33.9 61.1,34.1 60.8,34.4 60.8,35.3 60.8,40.7 60.7,40.8 57.5,40.8
+5V  (via drill 0.35)
  Top 0.152: IC4.10 96.83,6.33 v96.8,6.3 | IC3.10 64.85,54.1 v63.2,54.1 | IC2.10 63.02,74.17 v63,74.2 | IC5.10 51.73,65.83 v51.9,66 | IC6.10 51.98,45.83 v52,45.8 | IC7.10 48.33,25.82 v48.3,25.8 | IC1.10 16.82,6.67 v16.8,6.7
  Top 0.305: C8.1 50.15,74.85 v50.2,74.8 50.07,74.67 IC5.16 | IC2.16 64.75,66.38 v64.75,65.4 C5.1 | C4.1 64.85,45.35 v64.8,45.4 64.93,45.53 IC3.16 | IC6.16 50.07,54.37 v50.1,54.4 50.15,54.45 C3.1 | IC7.16 50.07,34.47 v50.1,34.5 49.95,34.65 C2.1 | IC4.16 104.35,7.83 v104.35,5.6 C1.1 | C7.1 89.46,14.61 v89.46,13.8 U2.14 | IC1.16 v25.4,4.93 26.88,4.93 C6.1
  Top 0.406: CN1.VBUS 41.4,8.56 41.34,8.5 v40.4,8.5 | CN1.VBUS v41.4,11 C13.1 42.65,13.05 v42.7,13.1 | CN1.VBUS 41.4,9.66 40.76,10.3 v40.4,10.3
  Top 0.508: U4.1 v54.2,39.94 53.09,39.94 C21.1 | U4.3 55.36,38.06 v54.7,37.4
  pour Route15 (no thermals): 52,37 56,37 56,43 87,43 87,0 117,0 117,89 -1,89 -1,0 52,0
ADC1_IN0  (via drill 0.35)
  Top 0.152: U1.14 69.45,29.75 67.7,28 63.7,28 60.1,31.6 57.7,31.6 55.4,29.3 55.4,27.3 v51.3,23.2 | TM1.2 34.6,7 v36.4,5.2
  Bottom 0.152: v36.4,5.2 39.5,8.3 39.5,8.9 39.8,9.2 44.2,9.2 45.8,10.8 45.8,19.2 49.8,23.2 v51.3,23.2
B1
  Top 0.152: R49.2 34.13,11.68 T1.3
B2
  Top 0.152: R50.2 35.81,15.36 T2.3
B3
  Top 0.152: R51.2 31.51,14.76 T3.3
B4
  Top 0.152: R52.2 25.85,17.52 T4.3
B5
  Top 0.152: R53.2 20.02,16.83 T5.3
B6
  Top 0.152: T6.3 17.52,17.5 18.4,17.5 19,16.9 R54.2
B7
  Top 0.152: T7.3 13.53,17.5 15.35,17.5 R55.2
B8
  Top 0.152: R56.2 11.18,15.85 T8.3
C1  (via drill 0.35)
  Top 0.305: T4.1 33.92,19.72 v35,20.8
  Bottom 0.305: DS3.8 76.6,60.41 | 76.6,60.41 76.6,48.5 79.1,46 | 79.1,46 80.18,44.92 DS2.8 | 79.1,46 77.9,44.8 77.9,28.1 79.1,26.9 79.1,25.6 79.78,24.92 DS1.8 | 76.6,60.41 43.61,60.41 38.3,55.1 38.3,21 38.1,20.8 v35,20.8
C2  (via drill 0.35)
  Top 0.305: v84.9,60.4 64.3,60.4 v63.2,59.3 | T3.1 35.02,18.62 36.1,19.7 v38.8,19.7
  Bottom 0.305: DS1.6 79.5,31.61 79.5,38.23 DS2.6 84.9,46.21 v84.9,60.4 84.9,63.63 DS3.6 | v63.2,59.3 44.8,59.3 39.5,54 39.5,20.4 v38.8,19.7
C3  (via drill 0.35)
  Top 0.305: DS3.2 96.35,62.95 92.9,59.5 66,59.5 v64.9,58.4 | T2.1 39.32,18.22 v39.9,18.8
  Bottom 0.305: DS3.2 96.35,60.95 101.1,56.2 101.1,50.8 96.35,46.05 DS2.2 96.35,42.55 100.9,38 100.9,30.6 96.35,26.05 DS1.2 | v64.9,58.4 64.2,57.7 46,57.7 40.6,52.3 40.6,19.5 v39.9,18.8
C4  (via drill 0.35)
  Top 0.305: DS3.1 98.89,62.09 94.8,58 83.7,58 82.9,58.8 67.6,58.8 v66.2,57.4 | v38.2,14.4 37.52,13.72 T1.1
  Bottom 0.305: DS1.1 102.6,28.63 102.6,41.21 DS2.1 102.6,48.63 102.6,61.21 DS3.1 | v66.2,57.4 65.3,56.5 47.9,56.5 41.8,50.4 41.8,39 42.9,37.9 42.9,35 41.6,33.7 41.6,17.8 v38.2,14.4
C5
  Top 0.305: T8.1 5.78,20.18 5.78,22.08 8.62,24.92 DS6.8
  Bottom 0.305: DS4.8 11.4,60.21 11.4,44.9 | DS6.8 11.4,29.63 11.4,44.9 | DS5.8 16.09,44.9 11.4,44.9
C6
  Top 0.305: T7.1 9.98,21.68 11.7,23.4 19.67,23.4 DS6.6
  Bottom 0.305: DS4.6 20,63.73 20,44.8 | DS5.6 21.07,44.8 20,44.8 | 20,44.8 20,24.9 21.17,24.9 DS6.6
C7
  Top 0.305: T6.1 13.98,21.18 15.3,22.5 28.93,22.5 DS6.2
  Bottom 0.305: DS4.2 30.1,63.67 30.1,45 | DS6.2 30.1,26.17 30.1,45 | DS5.2 30.18,44.92 30.1,45
C8
  Top 0.305: T5.1 17.98,20.38 19.2,21.6 30.57,21.6 DS6.1
  Bottom 0.305: DS4.1 35.9,62.91 35.9,46.93 DS5.1 35.5,43.31 35.5,26.5 33.92,24.92 DS6.1
CAN_RX
  Top 0.152: U1.61 67.25,19.85 66,18.6 62.6,18.6 62.09,18.09 U3.4
CAN_TX
  Top 0.152: U1.62 67.75,19.45 65.91,17.61 U3.1
GND  (via drill 0.35)
  Top 0.152: IC3.13 64.96,50.4 v66.8,50.4
  Top 0.254: U1.47 57.5,23.75 C19.2 55.65,23.25 v55.4,23 | U1.18 68.25,33.55 68.8,34.1 69.6,34.1 69.85,34.35 C15.2 69.7,35.15 v69.7,36.4 | U1.31 61.75,34.9 C16.2 61.5,35.35 v61.5,36.4 | U1.12 72.4,28.75 C14.2 73.95,28.15 v74.3,28.5 | C11.2 82.8,27.95 v82.8,26.8 | C10.2 v84,22 | U1.63 68.25,19.9 C18.2 69.15,17.55 v69.6,17.1 | C17.2 72.85,20.3 v71.7,20.3 | v64.6,14.9 64.6,16.43 U3.2
  Top 0.305: IC5.8 45.76,64.56 v45.8,64.6 | IC5.13 48.23,69.64 v48.2,69.6 | C8.2 51.85,74.75 v51.9,74.7 | C5.2 63.05,65.55 v63,65.6 | C4.2 63.15,45.25 v63.1,45.3 | C3.2 51.85,54.75 v51.7,54.6 | v51.6,34.5 51.65,34.55 C2.2 52.6,36 v52.8,35.8 | C21.2 52.75,38.4 v51.8,38.4 | C1.2 102.65,5.65 v102.8,5.8 | C7.2 91.1,14.55 v91.1,13.7 | IC4.8 95.56,12.45 v95.6,12.4 | IC4.13 100.64,9.77 v100.6,9.8 | C9.2 82.95,14.85 v83.3,14.5 | U2.7 82.99,5.19 v82.9,5.1 | D1.3 v57.9,4.9 | C6.2 26.85,3.3 v25.5,3.3 | IC2.8 69.34,75.44 v69.3,75.4 | v66.7,70.2 65.09,70.2 IC2.13 | IC6.8 43.97,44.6 v45.7,44.6 | IC6.13 48.44,49.63 v48.4,49.6 | IC7.8 43.97,24.6 v45.8,24.6 | IC7.13 48.53,29.64 v48.5,29.6 | IC3.8 69.25,55.45 v69.2,55.5 | v8,22 8.02,21.98 T8.2 7.96,21 v7,21 | v12,22.1 12.02,22.08 T7.2 v13,20.94 | v17.1,21.4 16.48,21.4 T6.2 16.56,20.4 v17,20.4 | v21.2,20.3 20.38,20.3 T5.2 20.82,19.14 21.16,19.14 v21.2,19.1 | T4.2 27.94,16.56 v28,16.5 | T3.2 33.44,15.44 v33.3,15.3 | T2.2 38.46,16.9 v38.6,16.9 | T1.2 38.82,11.68 v38.9,11.6
  Top 0.406: CN1.GND v44.6,11 | CN1.GND 45.26,9.06 v45.5,9.3 | v43.31,6.4 43.48,6.58 43.48,6.71 44.6,7.83 CN1.GND | C13.2 41.55,14.6 v42.8,14.6
  Top 0.508: IC1.8 15.5,11.02 v15.5,9.3 | U4.2 54.7,39 v54.4,38.7
  Top 1.016: C12.2 v60,43
  Bottom 0.254: C20.2 64.6,15.75 v64.6,14.9
  other vias: 64.8,29.8 68,29.6 67.9,12 69.9,11.2 68.2,6.5 92.9,9.2 94.2,41.1 68.1,53.5 87.6,7.1 60.8,52.8 17.3,1.4 18.8,6.8 91.6,11.5
  pour Route2 (no thermals): -1,87 116,87 116,-1 -1,-1
  pour Bottom (no thermals): -0.8,86.6 116.2,86.6 116.2,-1.4 -0.8,-1.4
  pour Top (rank 2, no thermals): -1.3,87.5 115.7,87.5 115.7,-0.5 -1.3,-0.5
N$1
  Top 0.152: R1.1 72.5,62 66.67,67.83 IC2.15
N$2
  Top 0.152: IC2.1 72.59,66.56 R2.1
N$3
  Top 0.152: IC2.2 73.33,67.83 R3.1
N$4
  Top 0.152: IC2.3 74.06,69.09 R4.1
N$5
  Top 0.152: IC2.4 73.73,70.36 74.1,70 R5.1
N$6
  Top 0.152: IC2.5 73.28,71.64 73.65,72 R6.1
N$7
  Top 0.152: IC2.6 72.81,72.91 73.9,74 R7.1
N$8
  Top 0.152: IC2.7 72.28,74.17 74.1,76 R8.1
N$9
  Top 0.152: IC3.15 66.58,47.83 71.4,43 R9.1
N$10
  Top 0.152: IC3.1 72.44,46.55 74,45 R10.1
N$11
  Top 0.152: IC3.2 72.78,47.83 73.6,47 R11.1
N$12
  Top 0.152: IC3.3 75.06,49.09 R12.1
N$13
  Top 0.152: R13.1 73.8,51 73.17,50.37 IC3.4
N$14
  Top 0.152: IC3.5 72.53,51.63 73.9,53 R14.1
N$15
  Top 0.152: R15.1 74.1,55 72.2,53.1 71.27,53.1 IC3.6
N$16
  Top 0.152: IC3.7 71.78,54.17 73.4,55.8 73.4,56.2 74.2,57 R16.1
N$17  (via drill 0.35)
  Top 0.152: R16.2 79.2,57 80,57.8 v82.2,57.8
  Bottom 0.152: v82.2,57.8 82.2,46.37 DS2.7
N$18
  Top 0.152: R15.2 78.7,55 80.3,56.6 94.83,56.6 DS2.15
N$19
  Top 0.152: R14.2 84.11,53 DS2.11
N$20  (via drill 0.35)
  Top 0.152: R13.2 88.6,51 v88.7,50.9
  Bottom 0.152: v88.7,50.9 88.7,44.95 DS2.5
N$21  (via drill 0.35)
  Top 0.152: R12.2 v93.4,49
  Bottom 0.152: v93.4,49 93.81,48.59 DS2.3
N$22  (via drill 0.35)
  Top 0.152: R11.2 77.15,47.3 91,47.3 v91.2,47.5
  Bottom 0.152: v91.2,47.5 91.2,55.01 DS2.13
N$23
  Top 0.152: R10.2 78.25,46.4 96.6,46.4 98.89,48.69 DS2.16
N$24  (via drill 0.35)
  Top 0.152: R9.2 77.85,42 94,42 v95,43
  Bottom 0.152: v95,43 95,51.9 93.81,53.09 DS2.14
N$25  (via drill 0.35)
  Top 0.152: v85,77.2 80.2,77.2 79,76 R8.2
  Bottom 0.152: DS3.7 83.65,72.35 85,73.7 v85,77.2
N$26
  Top 0.152: R7.2 79.2,74 79.8,73.4 94.67,73.4 DS3.15
N$27  (via drill 0.35)
  Top 0.152: R6.2 v86.1,72
  Bottom 0.152: v86.1,72 86.1,74.99 DS3.11
N$28  (via drill 0.35)
  Top 0.152: R5.2 v88.5,70
  Bottom 0.152: v88.5,70 88.73,69.77 DS3.5
N$29
  Top 0.152: R4.2 91.8,68 93.81,65.99 DS3.3
N$30  (via drill 0.35)
  Top 0.152: R3.2 78.2,66 79.1,66.9 v90.5,66.9
  Bottom 0.152: v90.5,66.9 91.27,67.67 DS3.13
N$31
  Top 0.152: R2.2 79.5,64 80.3,63.2 93.9,63.2 95.1,64.4 95.1,69.4 98.89,73.19 DS3.16
N$32  (via drill 0.35)
  Top 0.152: R1.2 92.3,62 v92.4,62.1
  Bottom 0.152: v92.4,62.1 92.6,62.3 92.6,71.3 93.81,72.51 DS3.14
N$33
  Top 0.152: IC4.15 103.17,9.97 107,13.8 R17.1
N$34
  Top 0.152: IC4.1 104.44,15.95 105,16.5 R18.1
N$35
  Top 0.152: IC4.2 103.17,17.98 R19.1
N$36
  Top 0.152: IC4.3 101.91,16.2 101,17.1 R20.1
N$37
  Top 0.152: IC4.4 100.64,15.66 99,17.3 R21.1
N$38
  Top 0.152: IC4.5 99.36,15.54 98,16.9 97.4,16.9 97,17.3 R22.1
N$39
  Top 0.152: IC4.6 98.09,15.51 96.9,16.7 95.7,16.7 95,17.4 R23.1
N$40
  Top 0.152: IC4.7 96.83,14.78 95.6,16 93.4,16 93,16.4 R24.1
N$41
  Top 0.152: R24.2 88.72,19.85 DS1.7
N$42  (via drill 0.35)
  Top 0.152: R23.2 95,21.1 v95.1,21.2
  Bottom 0.152: v95.1,21.2 95.1,32.6 96.35,33.85 DS1.15
N$43  (via drill 0.35)
  Top 0.152: R22.2 97,21.3 96.3,22 88.4,22 v87.8,22.6
  Bottom 0.152: v87.8,22.6 87.5,22.9 87.5,30.6 86.19,31.91 DS1.11
N$44
  Top 0.152: R21.2 99,21.9 98.3,22.6 91.05,22.6 DS1.5
N$45
  Top 0.152: R20.2 100.5,20.35 100.5,21.4 98.8,23.1 95.63,23.1 DS1.3
N$46
  Top 0.152: R19.2 103,29.3 99.3,33 93.35,33 DS1.13
N$47
  Top 0.152: DS1.16 105,28.97 R18.2
N$48
  Top 0.152: R17.2 107,31.7 101.4,37.3 96.03,37.3 DS1.14
N$49
  Top 0.152: IC5.15 48.23,72.17 43.4,77 R25.1
N$50
  Top 0.152: IC5.1 43.93,74.77 43.7,75 R26.1
N$51
  Top 0.152: IC5.2 42.62,72.17 41.8,73 R27.1
N$52
  Top 0.152: IC5.3 39.95,70.91 R28.1
N$53
  Top 0.152: IC5.4 40.48,69.64 R29.1
N$54
  Top 0.152: IC5.5 42.06,68.36 40.7,67 R30.1
N$55
  Top 0.152: IC5.6 41.95,67.09 R31.1
N$56
  Top 0.152: IC5.7 42.33,65.83 41.9,65.4 41.9,64.5 40.4,63 R32.1
N$57
  Top 0.152: R32.2 19.3,63 18.65,63.65 DS4.7
N$58  (via drill 0.35)
  Top 0.152: R31.2 36.4,65 v35.9,65.5
  Bottom 0.152: v35.9,65.5 31.35,70.05 DS4.15
N$59
  Top 0.152: R30.2 24.2,67 21.19,70.01 DS4.11
N$60  (via drill 0.35)
  Top 0.152: R29.2 v23.8,69
  Bottom 0.152: v23.8,69 23.8,64.99 DS4.5
N$61  (via drill 0.35)
  Top 0.152: R28.2 v28.7,71
  Bottom 0.152: v28.7,71 28.81,70.89 DS4.3
N$62
  Top 0.152: R27.2 27.3,73 26.27,74.03 DS4.13
N$63
  Top 0.152: R26.2 33.97,75 DS4.16
N$64
  Top 0.152: R25.2 29.4,77 28.81,76.41 DS4.14
N$65
  Top 0.152: IC6.15 48.33,52.17 43.5,57 R33.1
N$66
  Top 0.152: IC6.1 43.93,54.57 43.5,55 R34.1
N$67
  Top 0.152: R35.1 42.4,53 43.2,52.2 43.9,52.2 IC6.2
N$68
  Top 0.152: IC6.3 39.95,50.91 R36.1
N$69
  Top 0.152: IC6.4 40.48,49.63 R37.1
N$70
  Top 0.152: IC6.5 41.87,48.37 40.5,47 R38.1
N$71
  Top 0.152: IC6.6 41.95,47.09 R39.1
N$72
  Top 0.152: IC6.7 42.23,45.83 41.2,44.8 41.2,43.7 40.5,43 R40.1
N$73
  Top 0.152: R40.2 19.2,43 18.65,43.55 DS5.7
N$74  (via drill 0.35)
  Top 0.152: R39.2 36.95,46.2 v32.4,46.2
  Bottom 0.152: v32.4,46.2 31.35,47.25 DS5.15
N$75  (via drill 0.35)
  Top 0.152: R38.2 21.6,47 v21.3,47.3
  Bottom 0.152: v21.3,47.3 21.19,47.41 DS5.11
N$76  (via drill 0.35)
  Top 0.152: R37.2 23.9,49 v23.8,49.1
  Bottom 0.152: v23.8,49.1 23.8,44.99 DS5.5
N$77  (via drill 0.35)
  Top 0.152: R36.2 v28.8,51
  Bottom 0.152: v28.8,51 v28.81,50.99 DS5.3
N$78
  Top 0.152: R35.2 28.35,53 DS5.13
N$79
  Top 0.152: R34.2 33.97,55 DS5.16
N$80
  Top 0.152: R33.2 29.2,57 28.81,56.61 DS5.14
N$81  (via drill 0.35)
  Top 0.152: v41.9,37 R41.1 | IC7.15 50.1,32.2 v52,32.2
  Route15 0.152: v52,32.2 49.6,32.2 44.8,37 v41.9,37
N$82
  Top 0.152: IC7.1 43.9,33.47 43.9,34.3 43.2,35 R42.1
N$83
  Top 0.152: IC7.2 42.23,32.17 41.4,33 R43.1
N$84
  Top 0.152: IC7.3 39.95,30.91 R44.1
N$85
  Top 0.152: IC7.4 42.03,29.64 41.4,29 R45.1
N$86
  Top 0.152: IC7.5 42.16,28.36 40.8,27 R46.1
N$87
  Top 0.152: IC7.6 42.49,27.09 41.8,26.4 41.8,25.9 40.9,25 R47.1
N$88
  Top 0.152: IC7.7 42.73,25.82 42,25.1 42,23.8 41.2,23 R48.1
N$89
  Top 0.152: DS6.7 20.03,26.3 34.9,26.3 36.3,24.9 36.3,23.4 36.7,23 R48.2
N$90  (via drill 0.35)
  Top 0.152: R47.2 36.15,27 v31.4,27
  Bottom 0.152: v31.4,27 31.4,35.03 DS6.15
N$91  (via drill 0.35)
  Top 0.152: R46.2 37.35,27 36.55,27.8 21.9,27.8 v21.2,27.1
  Bottom 0.152: v21.2,27.1 DS6.11
N$92  (via drill 0.35)
  Top 0.152: v23.7,29 R45.2
  Bottom 0.152: DS6.5 23.73,28.97 v23.7,29
N$93  (via drill 0.35)
  Top 0.152: R44.2 28.9,31 v28.8,31.1
  Bottom 0.152: v28.8,31.1 DS6.3
N$94
  Top 0.152: R43.2 27.8,33 26.27,34.53 DS6.13
N$95
  Top 0.152: DS6.16 38.07,35.08 R42.2
N$96
  Top 0.152: R41.2 29.6,37 28.81,36.21 DS6.14
N$97
  Top 0.152: IC5.14 53.1,70.91 57.65,75.44 IC2.9
N$98
  Top 0.152: IC5.9 51.84,64.56 53.2,63.2 53.2,52.2 51.91,50.91 IC6.14
N$99
  Top 0.152: IC6.9 50.07,40.67 48.3,38.9 48.3,31.3 48.7,30.91 IC7.14
N$100  (via drill 0.35)
  Top 0.152: IC4.9 94.67,7.93 v94,8.6 | v92.6,40.4 92.5,40.5 64.5,40.5 61.3,43.7 61.3,47.7 62.7,49.09 IC3.14
  Bottom 0.152: v94,8.6 94,21.8 92.6,23.2 v92.6,40.4
N$101
  Top 0.152: IC2.14 62.3,69.09 61.5,68.3 61.5,56.3 62.35,55.45 IC3.9
N$102  (via drill 0.35)
  Top 0.152: IC1.14 21.91,3.1 22.7,2.3 35,2.3 v36.6,3.9 | v50,22.2 50.07,22.27 IC7.9
  Bottom 0.152: v36.6,3.9 39.21,6.51 39.21,6.66 40.15,7.6 45.5,7.6 46.6,8.7 46.6,18.8 v50,22.2
N$103
  Top 0.305: U3.7 64.64,9.96 65.27,9.33 CAN.1 65.27,5.1 | JP1.1 65.27,5.1 | D1.1 65.22,5.05 65.27,5.1
N$104
  Top 0.305: U3.6 63.37,10.06 62.73,9.43 CAN.2 60.55,7.4 D1.2 60.05,6.9 59.1,6.9 58.7,7.3 56.8,7.3 56.4,6.9 56.4,3.4 R60.1
N$105
  Top 0.305: JP1.2 61.4,3 61.2,2.8 R60.2
N$107  (via drill 0.35)
  Top 0.152: RST.2 RST.1 70.9,7.41 R57.1 | U1.7 69.05,26.25 v69,26.3
  Bottom 0.152: v69,26.3 68.8,26.1 68.8,8.4 69.94,7.26 RST.1
N$108
  Top 0.254: C10.1 80.74,21.59 Q1.1 73.34,25.25 U1.5
N$109
  Top 0.254: C11.1 79.56,26.41 Q1.2 76.34,25.75 U1.6
N$110  (via drill 0.35)
  Top 0.152: U1.60 66.75,20.15 66.3,19.7 v63.1,19.7
  Bottom 0.152: v63.1,19.7 61.9,19.7 56.7,14.5 53.7,14.5 53,13.8 BOOT0.2
N$113
  Top 0.152: R49.1 23.9,7.3 23.18,6.58 IC1.15
N$114
  Top 0.152: IC1.1 25.23,11.07 27,9.3 R50.1
N$115
  Top 0.152: IC1.2 23.18,12.38 23.6,12.8 27.85,12.8 R51.1
N$116
  Top 0.152: IC1.3 21.91,12.8 24.15,15.05 R52.1
N$117
  Top 0.152: IC1.4 20.64,13.79 R53.1
N$118
  Top 0.152: IC1.5 19.36,13.79 R54.1
N$119
  Top 0.152: IC1.6 18.09,12.4 17,13.5 R55.1
N$120
  Top 0.152: IC1.7 16.82,12.38 16.5,12.7 15.6,12.7 15,13.3 R56.1
PWM
  Top 0.152: U2.2 80.16,11.54 77.6,14.1 61.9,14.1 60.9,15.1 60.9,18.5 61.75,19.35 U1.50
RCK  (via drill 0.35)
  Top 0.152: IC4.12 99.36,5.87 98.8,5.3 95.3,5.3 91.6,9 U2.11 88.2,9 v87.6,8.4 | IC2.12 58.53,71.64 55.27,68.36 IC5.12 48.56,68.36 48.3,68.1 48.3,65.6 48.71,65.19 54.31,65.19 56.3,63.2 56.3,55.4 60.06,51.63 | 60.06,51.63 v60.7,51.63 IC3.12 | 60.06,51.63 56.8,48.37 IC6.12 48.47,48.37 47.6,47.5 47.6,28.9 48.13,28.36 IC7.12 | v19.5,2.6 19.36,2.73 IC1.12
  Bottom 0.152: v60.7,51.63 60.87,51.63 72.2,40.3 72.2,27.5 76.6,23.1 77.6,23.1 86.1,14.6 86.1,9.9 v87.6,8.4 83.2,4 78.5,4 78.2,4.3 66.9,4.3 66.3,4.9 59.9,4.9 58.9,3.9 54.4,3.9 53.8,4.5 46.3,4.5 46,4.2 39.2,4.2 37.9,2.9 26.8,2.9 26.4,2.5 19.6,2.5 v19.5,2.6
RCK_STM  (via drill 0.35)
  Top 0.152: U2.4 78.3,9 75.1,12.2 v70.5,12.2 | v67.3,30.7 67.25,30.75 U1.20
  Bottom 0.152: v70.5,12.2 70.5,28.7 68.6,30.6 67.4,30.6 v67.3,30.7
SCK  (via drill 0.35)
  Top 0.152: IC4.11 98.09,9.4 97.23,10.27 U2.12 87.87,10.27 v87.8,10.2 | IC5.11 56.8,67.09 | IC2.11 66.69,72.91 67,72.6 67,71.7 66.3,71 60.7,71 56.8,67.09 | 56.8,67.09 59.2,64.69 59.2,56.2 62.4,53 64.83,53 64.87,52.97 | 64.87,52.97 IC3.11 | IC6.11 55,47.09 | 55,47.09 57.59,47.09 61.5,51 66.3,51 66.9,51.6 66.9,52.5 | 64.87,52.97 66.43,52.97 66.9,52.5 | IC7.11 51.7,27.1 53.3,28.7 53.3,33.6 54.6,34.9 54.6,35.6 53.1,37.1 51.3,37.1 50.9,37.5 50.9,41.8 55,45.9 55,47.09 | v68.2,52.5 66.9,52.5 | IC1.11 v18.09,2.5 v18.1,2.5
  Bottom 0.152: v68.2,52.5 68.2,46.6 75.8,39 75.8,25.3 76.8,24.3 78.4,24.3 87.8,14.9 v87.8,10.2 88.8,9.2 88.8,5.3 86.3,2.8 81.9,2.8 80.4,1.3 19.2,1.3 18.1,2.4 v18.1,2.5
SDI
  Top 0.152: U2.10 91.47,7.73 94.7,4.5 100,4.5 101.91,6.41 IC4.14
SPI_MOSI  (via drill 0.35)
  Top 0.152: U2.5 81.43,7.73 79.1,5.4 v67.8,5.4 | v65.7,30.7 65.7,32.65 U1.23
  Bottom 0.152: v67.8,5.4 67,6.2 67,21.6 65.7,22.9 v65.7,30.7
SPI_SCK  (via drill 0.35)
  Top 0.152: U2.3 79.23,10.27 76.3,13.2 v67.9,13.2 | v67,29 67,29.7 66.5,30.2 66.5,31.3 66.75,31.55 U1.21
  Bottom 0.152: v67.9,13.2 67.9,28.1 v67,29
SWCLK
  Top 0.152: U1.49 61.25,19.95 58.1,16.8 58.1,16 56.7,14.6 51.2,14.6 50.73,15.07 DEBUG.2
SWDIO
  Top 0.152: DEBUG.3 53.27,22.77 54.75,24.25 U1.46

### Text on the board
tPlace: Tesla Coil Real Time Info Board / Will Buchta 11/2023 | +3v3 | SWCLK | SWDIO | GND | GND | HI | L | H
bPlace: COIL A | COIL B | CURRENT | JLCJLCJLCJLC | BUS | VOLTAGE | TEMP